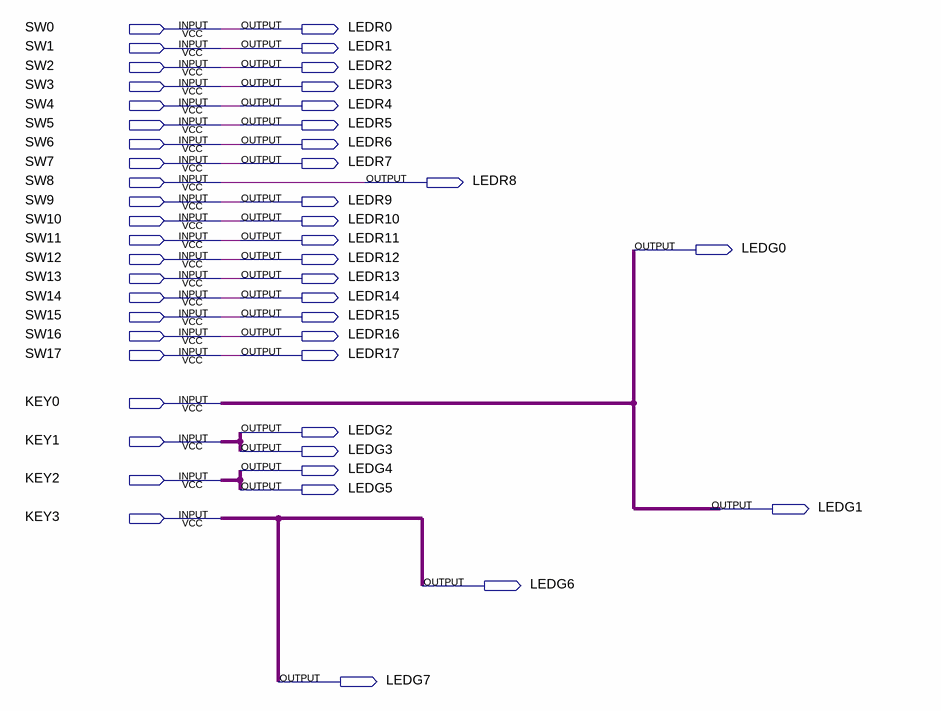
[diagram p0: schematic sheet]
// Quartus schematic muj_pokus.bdf as structural Verilog: 0 symbols, 48 pins
module muj_pokus (
  input  SW0,
  input  SW1,
  input  SW2,
  input  SW3,
  input  SW4,
  input  SW5,
  input  SW6,
  input  SW7,
  input  SW8,
  input  SW9,
  input  SW10,
  input  SW11,
  input  SW12,
  input  SW13,
  input  SW14,
  input  SW15,
  input  SW16,
  input  SW17,
  input  KEY0,
  input  KEY1,
  input  KEY2,
  input  KEY3,
  output LEDR0,
  output LEDR1,
  output LEDR2,
  output LEDR3,
  output LEDR4,
  output LEDR5,
  output LEDR6,
  output LEDR7,
  output LEDR8,
  output LEDR9,
  output LEDR10,
  output LEDR11,
  output LEDG0,
  output LEDR12,
  output LEDR13,
  output LEDR14,
  output LEDR15,
  output LEDR16,
  output LEDR17,
  output LEDG2,
  output LEDG3,
  output LEDG4,
  output LEDG5,
  output LEDG1,
  output LEDG6,
  output LEDG7
);


  assign LEDG0 = KEY0;
  assign LEDG1 = KEY0;
  assign LEDG2 = KEY1;
  assign LEDG3 = KEY1;
  assign LEDG4 = KEY2;
  assign LEDG5 = KEY2;
  assign LEDG6 = KEY3;
  assign LEDG7 = KEY3;
  assign LEDR0 = SW0;
  assign LEDR1 = SW1;
  assign LEDR2 = SW2;
  assign LEDR3 = SW3;
  assign LEDR4 = SW4;
  assign LEDR5 = SW5;
  assign LEDR6 = SW6;
  assign LEDR7 = SW7;
  assign LEDR8 = SW8;
  assign LEDR9 = SW9;
  assign LEDR10 = SW10;
  assign LEDR11 = SW11;
  assign LEDR12 = SW12;
  assign LEDR13 = SW13;
  assign LEDR14 = SW14;
  assign LEDR15 = SW15;
  assign LEDR16 = SW16;
  assign LEDR17 = SW17;
endmodule
